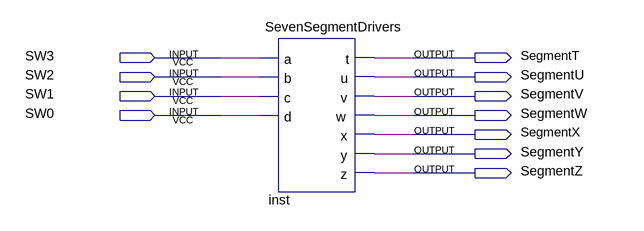
[diagram p0: schematic sheet]
// Quartus schematic P1Implementation.bdf as structural Verilog: 1 symbols, 11 pins
module P1Implementation (
  input  SW3,
  input  SW2,
  input  SW1,
  input  SW0,
  output SegmentT,
  output SegmentU,
  output SegmentV,
  output SegmentW,
  output SegmentX,
  output SegmentY,
  output SegmentZ
);

  SevenSegmentDrivers inst (
    .a(SW3), .b(SW2), .c(SW1), .d(SW0), .t(SegmentT), .u(SegmentU), .v(SegmentV), .w(SegmentW), .x(SegmentX),
    .y(SegmentY), .z(SegmentZ));
endmodule
